# EAGLE schematic W707P (EAGLE 4.11)
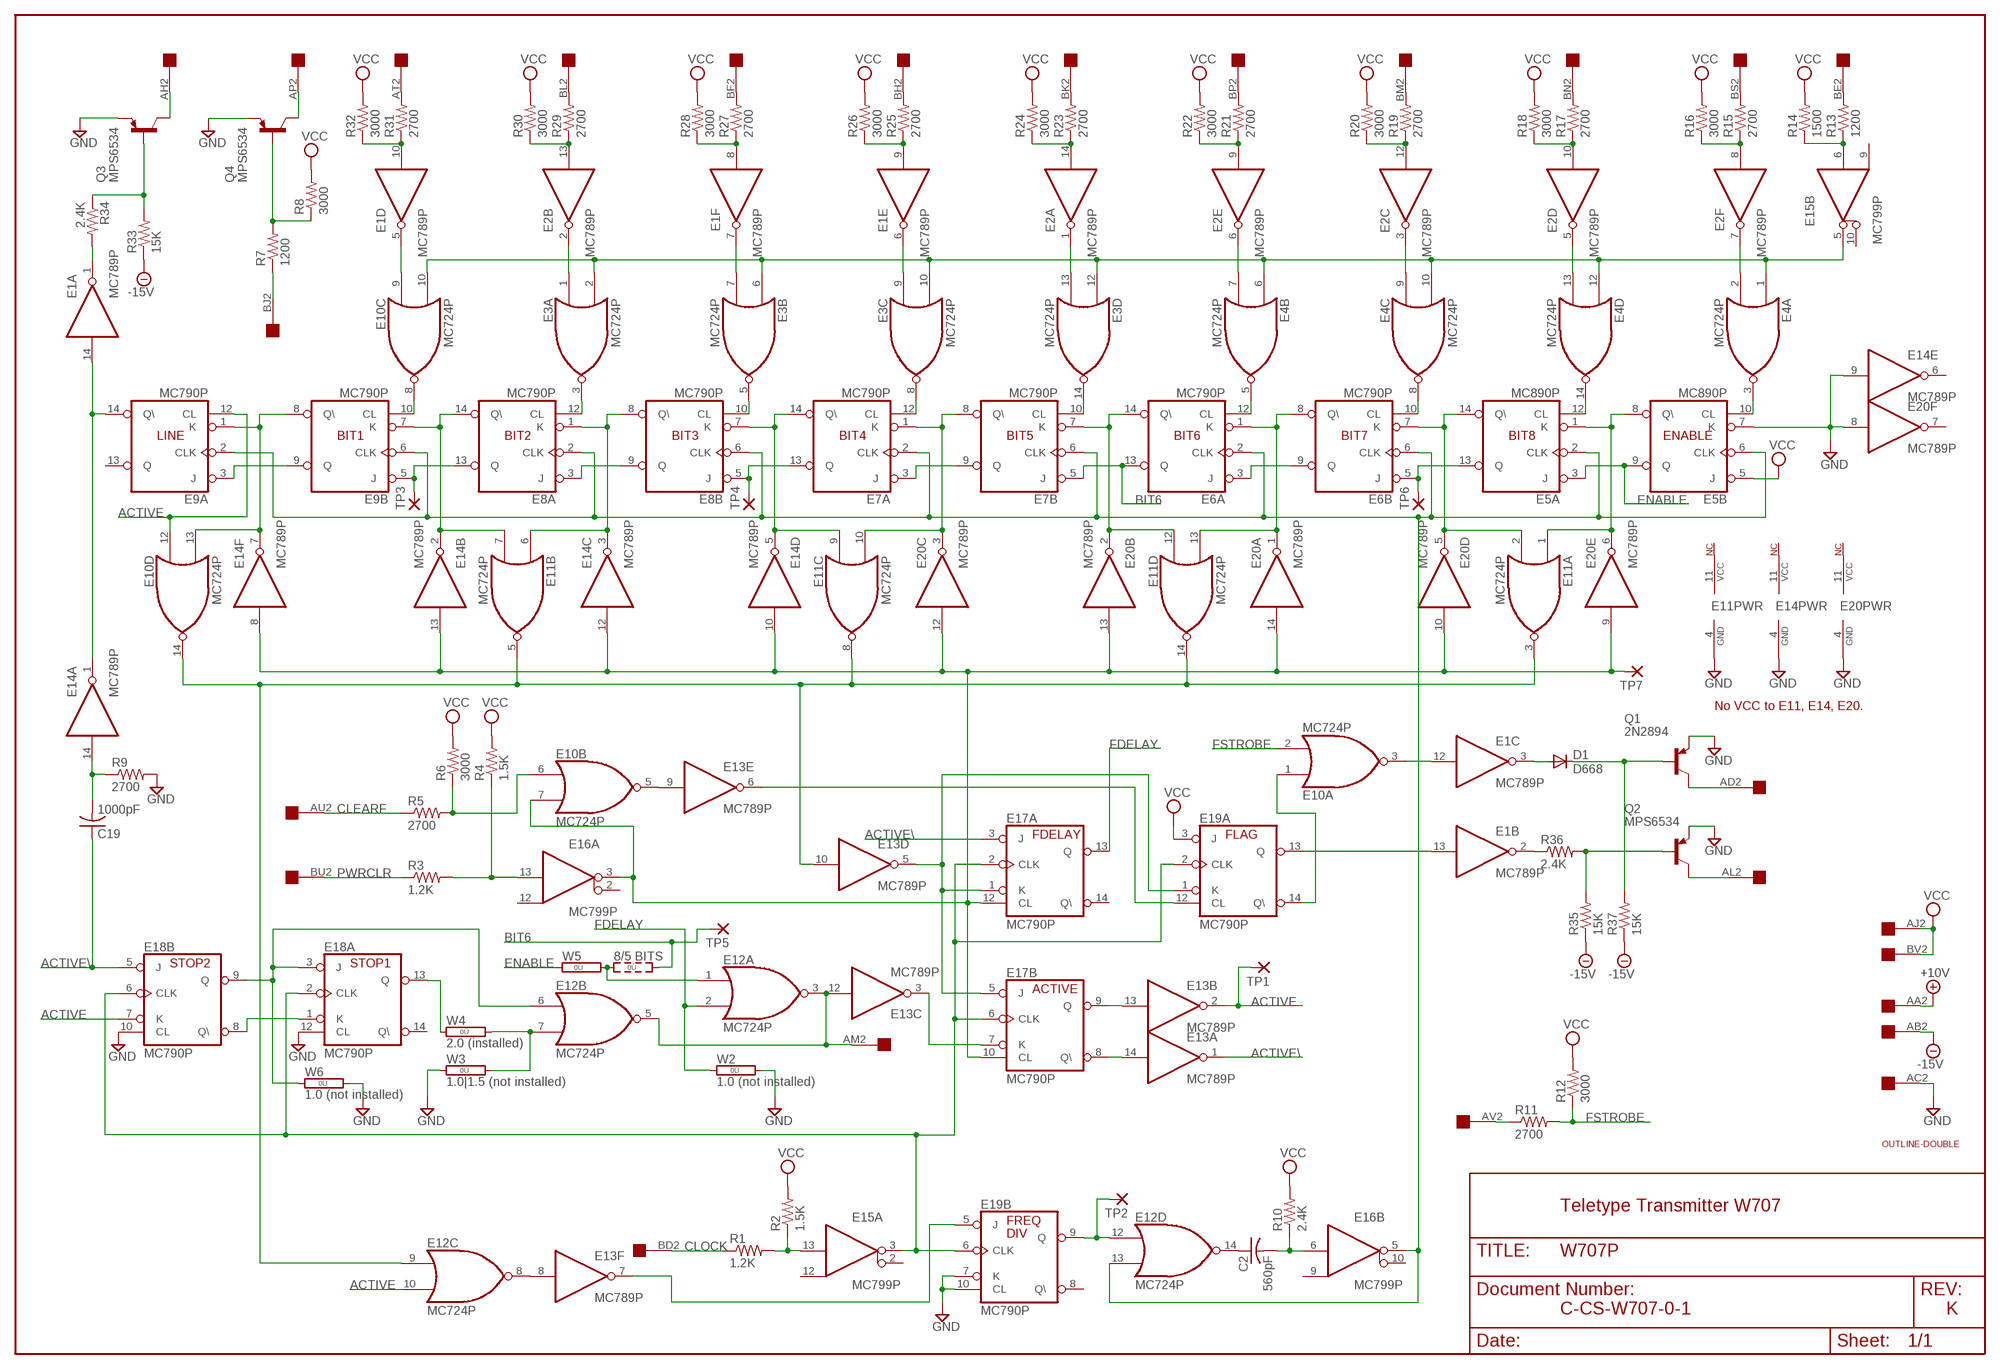
[diagram p0: schematic, sheet 1]

## Parts
C2  560pF  C-US050-025X075  [C050-025X075]
C19  1000pF  C-US050-025X075  [C050-025X075]
D1  D668  1N4148  [DO35-10]
E1  MC789P  MC889P  [DIL14]
E2  MC789P  MC889P  [DIL14]
E3  MC724P  MC824P  [DIL14]
E4  MC724P  MC824P  [DIL14]
E5  MC890P  [DIL14]
E6  MC790P  MC890P  [DIL14]
E7  MC790P  MC890P  [DIL14]
E8  MC790P  MC890P  [DIL14]
E9  MC790P  MC890P  [DIL14]
E10  MC724P  MC824P  [DIL14]
E11  MC724P  MC824P  [DIL14]
E12  MC724P  MC824P  [DIL14]
E13  MC789P  MC889P  [DIL14]
E14  MC789P  MC889P  [DIL14]
E15  MC799P  MC899P  [DIL14]
E16  MC799P  MC899P  [DIL14]
E17  MC790P  MC890P  [DIL14]
E18  MC790P  MC890P  [DIL14]
E19  MC790P  MC890P  [DIL14]
E20  MC789P  MC889P  [DIL14]
Q1  2N2894  2N2904  [TO39]
Q2  MPS6534  2N2904  [TO39]
Q3  MPS6534  2N2904  [TO39]
Q4  MPS6534  2N2904  [TO39]
R1  1.2K  R-US_0207/10  [0207/10]
R2  1.5K  R-US_0207/10  [0207/10]
R3  1.2K  R-US_0207/10  [0207/10]
R4  1.5K  R-US_0207/10  [0207/10]
R5  2700  R-US_0207/10  [0207/10]
R6  3000  R-US_0207/10  [0207/10]
R7  1200  R-US_0207/10  [0207/10]
R8  3000  R-US_0207/10  [0207/10]
R9  2700  R-US_0207/10  [0207/10]
R10  2.4K  R-US_0207/10  [0207/10]
R11  2700  R-US_0207/10  [0207/10]
R12  3000  R-US_0207/10  [0207/10]
R13  1200  R-US_0207/10  [0207/10]
R14  1500  R-US_0207/10  [0207/10]
R15  2700  R-US_0207/10  [0207/10]
R16  3000  R-US_0207/10  [0207/10]
R17  2700  R-US_0207/10  [0207/10]
R18  3000  R-US_0207/10  [0207/10]
R19  2700  R-US_0207/10  [0207/10]
R20  3000  R-US_0207/10  [0207/10]
R21  2700  R-US_0207/10  [0207/10]
R22  3000  R-US_0207/10  [0207/10]
R23  2700  R-US_0207/10  [0207/10]
R24  3000  R-US_0207/10  [0207/10]
R25  2700  R-US_0207/10  [0207/10]
R26  3000  R-US_0207/10  [0207/10]
R27  2700  R-US_0207/10  [0207/10]
R28  3000  R-US_0207/10  [0207/10]
R29  2700  R-US_0207/10  [0207/10]
R30  3000  R-US_0207/10  [0207/10]
R31  2700  R-US_0207/10  [0207/10]
R32  3000  R-US_0207/10  [0207/10]
R33  15K  R-US_0207/10  [0207/10]
R34  2.4K  R-US_0207/10  [0207/10]
R35  15K  R-US_0207/10  [0207/10]
R36  2.4K  R-US_0207/10  [0207/10]
R37  15K  R-US_0207/10  [0207/10]
TP1  3,17/1,3  [3,17/1,3]
TP2  3,17/1,3  [3,17/1,3]
TP3  3,17/1,3  [3,17/1,3]
TP4  3,17/1,3  [3,17/1,3]
TP5  3,17/1,3  [3,17/1,3]
TP6  3,17/1,3  [3,17/1,3]
TP7  3,17/1,3  [3,17/1,3]
U$1  OUTLINE-DOUBLE  [DOUBLE]
U$2  DOUBLE  [EDGE-CON4]
W2  1.0 (not installed)  0R  [0R/10]
W3  1.0|1.5 (not installed)  0R  [0R/10]
W4  2.0 (installed)  0R  [0R/10]
W5  8/5 BITS  0R2  [0R2/10]
W6  1.0 (not installed)  0R  [0R/10]

## Nets
+10V [Supply]: U$2.AA2
-15V [Supply]: R33.1 R35.1 R37.1 U$2.AB2
ACTIVE: E9.12(A:CL) E10.12(D:I0) E12.10(C:I1) E13.2(B:O) E18.7(B:K) TP1.1(P)
ACTIVE\: C19.1 E13.1(A:O) E17.3(A:J) E18.5(B:J)
BIT6: E6.13(A:Q) E7.5(B:J) TP5.1(P) W5.3
CLEARF: R5.1 U$2.AU2
CLOCK: R1.1 U$2.BD2
ENABLE: E5.3(A:J) E5.9(B:Q) W5.1
FDELAY: E12.2(A:I1) E17.13(A:Q) W2.1
FSTROBE: E10.2(A:I1) R11.2 R12.1
GND [Supply]: E5.7(B:K) E11.4(PWR:GND) E14.4(PWR:GND) E14.9(E:I) E18.10(B:CL) E18.12(A:CL) E19.7(B:K) E19.10(B:CL) E20.4(PWR:GND) E20.8(F:I) Q1.1(E) Q2.1(E) Q3.1(E) Q4.1(E) R9.2 U$2.AC2 W2.2 W3.1 W6.2
N$1: E1.5(D:O) E10.9(C:I0)
N$2: E2.2(B:O) E3.1(A:I0)
N$3: E1.7(F:O) E3.7(B:I1)
N$4: E1.6(E:O) E3.9(C:I0)
N$5: E2.1(A:O) E3.13(D:I1)
N$6: E2.6(E:O) E4.7(B:I1)
N$7: E2.3(C:O) E4.9(C:I0)
N$8: E2.5(D:O) E4.13(D:I1)
N$9: E2.7(F:O) E4.2(A:I1)
N$10: R31.2 U$2.AT2
N$11: R29.2 U$2.BL2
N$12: R27.2 U$2.BF2
N$13: E1.10(D:I) R31.1 R32.1
N$14: E1.8(F:I) R27.1 R28.1
N$15: R25.2 U$2.BH2
N$16: E1.9(E:I) R25.1 R26.1
N$17: R23.2 U$2.BK2
N$18: E2.14(A:I) R23.1 R24.1
N$19: E2.9(E:I) R21.1 R22.1
N$20: R21.2 U$2.BP2
N$21: R19.2 U$2.BM2
N$22: R17.2 U$2.BN2
N$23: R15.2 U$2.BS2
N$24: E2.13(B:I) R29.1 R30.1
N$25: E15.3(A:O) E17.2(A:CLK) E17.6(B:CLK) E18.2(A:CLK) E18.6(B:CLK) E19.2(A:CLK) E19.6(B:CLK)
N$26: E2.12(C:I) R19.1 R20.1
N$27: E2.10(D:I) R17.1 R18.1
N$28: E2.8(F:I) R15.1 R16.1
N$29: R13.2 U$2.BE2
N$30: E15.6(B:I) R13.1 R14.1
N$31: E3.2(A:I1) E3.6(B:I0) E3.10(C:I1) E3.12(D:I0) E4.1(A:I0) E4.6(B:I0) E4.10(C:I1) E4.12(D:I0) E10.10(C:I1) E15.5(B:O)
N$32: E5.2(A:CLK) E5.6(B:CLK) E6.2(A:CLK) E6.6(B:CLK) E7.2(A:CLK) E7.6(B:CLK) E8.2(A:CLK) E8.6(B:CLK) E9.2(A:CLK) E9.6(B:CLK) E12.13(D:I1) E16.5(B:O)
N$33: E8.1(A:K) E8.8(B:Q\) E11.6(B:I0) E14.3(C:O)
N$34: E8.3(A:J) E8.9(B:Q)
N$35: E7.14(A:Q\) E8.7(B:K) E11.9(C:I0) E14.5(D:O)
N$36: E7.13(A:Q) E8.5(B:J) TP4.1(P)
N$37: E7.3(A:J) E7.9(B:Q)
N$38: E7.1(A:K) E7.8(B:Q\) E11.10(C:I1) E20.3(C:O)
N$39: E6.14(A:Q\) E7.7(B:K) E11.12(D:I0) E20.2(B:O)
N$40: E12.1(A:I0) W5.2
N$41: E6.1(A:K) E6.8(B:Q\) E11.13(D:I1) E20.1(A:O)
N$42: E6.3(A:J) E6.9(B:Q)
N$43: E5.14(A:Q\) E6.7(B:K) E11.2(A:I1) E20.5(D:O)
N$44: E5.13(A:Q) E6.5(B:J) TP6.1(P)
N$45: E5.1(A:K) E5.8(B:Q\) E11.1(A:I0) E20.6(E:O)
N$46: Q4.3(C) U$2.AP2
N$47: E4.3(A:O) E5.10(B:CL)
N$48: E3.14(D:O) E7.10(B:CL)
N$49: E4.5(B:O) E6.12(A:CL)
N$50: E4.8(C:O) E6.10(B:CL)
N$51: E4.14(D:O) E5.12(A:CL)
N$52: E3.8(C:O) E7.12(A:CL)
N$53: E13.7(F:O) E19.5(B:J)
N$54: E8.14(A:Q\) E9.7(B:K) E11.7(B:I1) E14.2(B:O)
N$55: E8.13(A:Q) E9.5(B:J) TP3.1(P)
N$56: E9.10(B:CL) E10.8(C:O)
N$57: E3.5(B:O) E8.10(B:CL)
N$58: E15.13(A:I) R1.2 R2.1
N$59: E16.13(A:I) R3.2 R4.1
N$60: E3.3(A:O) E8.12(A:CL)
N$61: E9.1(A:K) E9.8(B:Q\) E10.13(D:I1) E14.7(F:O)
N$62: E9.3(A:J) E9.9(B:Q)
N$63: E1.14(A:I) E9.14(A:Q\) E14.1(A:O)
N$64: E1.1(A:O) R34.2
N$65: Q3.2(B) R33.2 R34.1
N$66: E10.7(B:I1) E14.8(F:I) E14.10(D:I) E14.12(C:I) E14.13(B:I) E16.3(A:O) E17.10(B:CL) E17.12(A:CL) E20.9(E:I) E20.10(D:I) E20.12(C:I) E20.13(B:I) E20.14(A:I) TP7.1(P)
N$67: Q3.3(C) U$2.AH2
N$68: E10.14(D:O) E11.3(A:O) E11.5(B:O) E11.8(C:O) E11.14(D:O) E12.9(C:I0) E13.10(D:I)
N$69: E12.12(D:I0) E19.9(B:Q) TP2.1(P)
N$71: C2.1 E12.14(D:O)
N$72: C2.2 E16.6(B:I) R10.1
N$73: E12.8(C:O) E13.8(F:I)
N$74: E13.14(A:I) E17.8(B:Q\)
N$75: E13.13(B:I) E17.9(B:Q)
N$76: E18.13(A:Q) W4.1
N$77: E13.3(C:O) E17.7(B:K)
N$78: E12.3(A:O) E12.5(B:O) E13.12(C:I) U$2.AM2
N$79: Q4.2(B) R7.2 R8.1
N$80: E12.6(B:I0) E18.3(A:J) E18.9(B:Q) W6.1
N$81: E10.1(A:I0) E19.14(A:Q\)
N$82: E12.7(B:I1) W3.2 W4.2
N$83: R7.1 U$2.BJ2
N$84: R11.1 U$2.AV2
N$85: E10.5(B:O) E13.9(E:I)
N$86: Q2.2(B) R35.2 R36.2
N$87: Q2.3(C) U$2.AL2
N$88: Q1.3(C) U$2.AD2
N$89: D1.C Q1.2(B) R37.2
N$90: D1.A E1.3(C:O)
N$91: E1.2(B:O) R36.1
N$92: E1.12(C:I) E10.3(A:O)
N$93: C19.2 E14.14(A:I) R9.1
N$94: E13.5(D:O) E17.1(A:K) E17.5(B:J) E19.1(A:K)
N$96: E13.6(E:O) E19.12(A:CL)
N$97: E1.13(B:I) E19.13(A:Q)
N$98: E18.1(A:K) E18.8(B:Q\)
N$105: E10.6(B:I0) R5.2 R6.1
NC: E11.11(PWR:VCC) E14.11(PWR:VCC) E20.11(PWR:VCC)
PWRCLR: R3.1 U$2.BU2
VCC [Supply]: E5.5(B:J) E19.3(A:J) R2.2 R4.2 R6.2 R8.2 R10.2 R12.2 R14.2 R16.2 R18.2 R20.2 R22.2 R24.2 R26.2 R28.2 R30.2 R32.2 U$2.AJ2 U$2.BV2
Unconnected: E9.13(A:Q) E14.6(E:O) E15.2(A:E) E15.9(B:R) E15.10(B:E) E15.12(A:R) E16.2(A:E) E16.9(B:R) E16.10(B:E) E16.12(A:R) E17.14(A:Q\) E18.14(A:Q\) E19.8(B:Q\) E20.7(F:O) U$2.AA1 U$2.AB1 U$2.AC1 U$2.AD1 U$2.AE1 U$2.AE2 U$2.AF1 U$2.AF2 U$2.AH1 U$2.AJ1 U$2.AK1 U$2.AK2 U$2.AL1 U$2.AM1 U$2.AN1 U$2.AN2 U$2.AP1 U$2.AR1 U$2.AR2 U$2.AS1 U$2.AS2 U$2.AT1 U$2.AU1 U$2.AV1 U$2.BA1 U$2.BA2 U$2.BB1 U$2.BB2 U$2.BC1 U$2.BC2 U$2.BD1 U$2.BE1 U$2.BF1 U$2.BH1 U$2.BJ1 U$2.BK1 U$2.BL1 U$2.BM1 U$2.BN1 U$2.BP1 U$2.BR1 U$2.BR2 U$2.BS1 U$2.BT1 U$2.BT2 U$2.BU1 U$2.BV1

## Notes on the sheet
- LINE | BIT1 | BIT2 | BIT3 | BIT4 | BIT5 | BIT6 | BIT7 | BIT8 | ENABLE
- No VCC to E11, E14, E20.
- FDELAY | FLAG
- STOP2 | STOP1
- ACTIVE
- Teletype Transmitter W707
- FREQ
- DIV
- C-CS-W707-0-1 | K

## Power pins joined to a net without a drawn wire
GND: E1.4(PWR:GND) E2.4(PWR:GND) E3.4(PWR:GND) E4.4(PWR:GND) E5.4(PWR:GND) E6.4(PWR:GND) E7.4(PWR:GND) E8.4(PWR:GND) E9.4(PWR:GND) E10.4(PWR:GND) E12.4(PWR:GND) E13.4(PWR:GND) E15.4(PWR:GND) E16.4(PWR:GND) E17.4(PWR:GND) E18.4(PWR:GND) E19.4(PWR:GND)
VCC: E1.11(PWR:VCC) E2.11(PWR:VCC) E3.11(PWR:VCC) E4.11(PWR:VCC) E5.11(PWR:VCC) E6.11(PWR:VCC) E7.11(PWR:VCC) E8.11(PWR:VCC) E9.11(PWR:VCC) E10.11(PWR:VCC) E12.11(PWR:VCC) E13.11(PWR:VCC) E15.11(PWR:VCC) E16.11(PWR:VCC) E17.11(PWR:VCC) E18.11(PWR:VCC) E19.11(PWR:VCC)

## Library data of the parts
C2 C19 = rcl:C-US: CAPACITOR, American symbol
D1 = diode:1N4148: DIODE high speed (Philips)
E1 E2 E13 E14 E20 = dec-con:MC889: RTL Hex Inverter
E3 E4 E10-E12 = dec-con:MC824: RTL Quad NOR Gate
E5-E9 E17-E19 = dec-con:MC890: RTL Dual JK Flip-Flop
E15 E16 = dec-con:MC899: RTL Dual Buffer
Q1-Q4 = transistor-pnp:2N2904*: PNP Transistror
R1-R37 = rcl:R-US_: RESISTOR, American symbol
TP1-TP7 = wirepad:3,17/1,3: THROUGH-HOLE PAD
U$1 = dec-con:OUTLINE-*: Board outlines for DEC boards.
U$2 = dec-con:DOUBLE: Double-Height DEC board
W2-W4 W6 = jumper:0R: Bridge 0R 10mm
W5 = jumper:0R2: Bridge switch 0R 2 x 10mm

## Net classes
1 Supply: width 0.813 mm